# Altium schematic sheet Main IF Board 8.SchDoc: Up Converter DDR and 1st IF
size A3; Author: L Lerner; Revision: 0
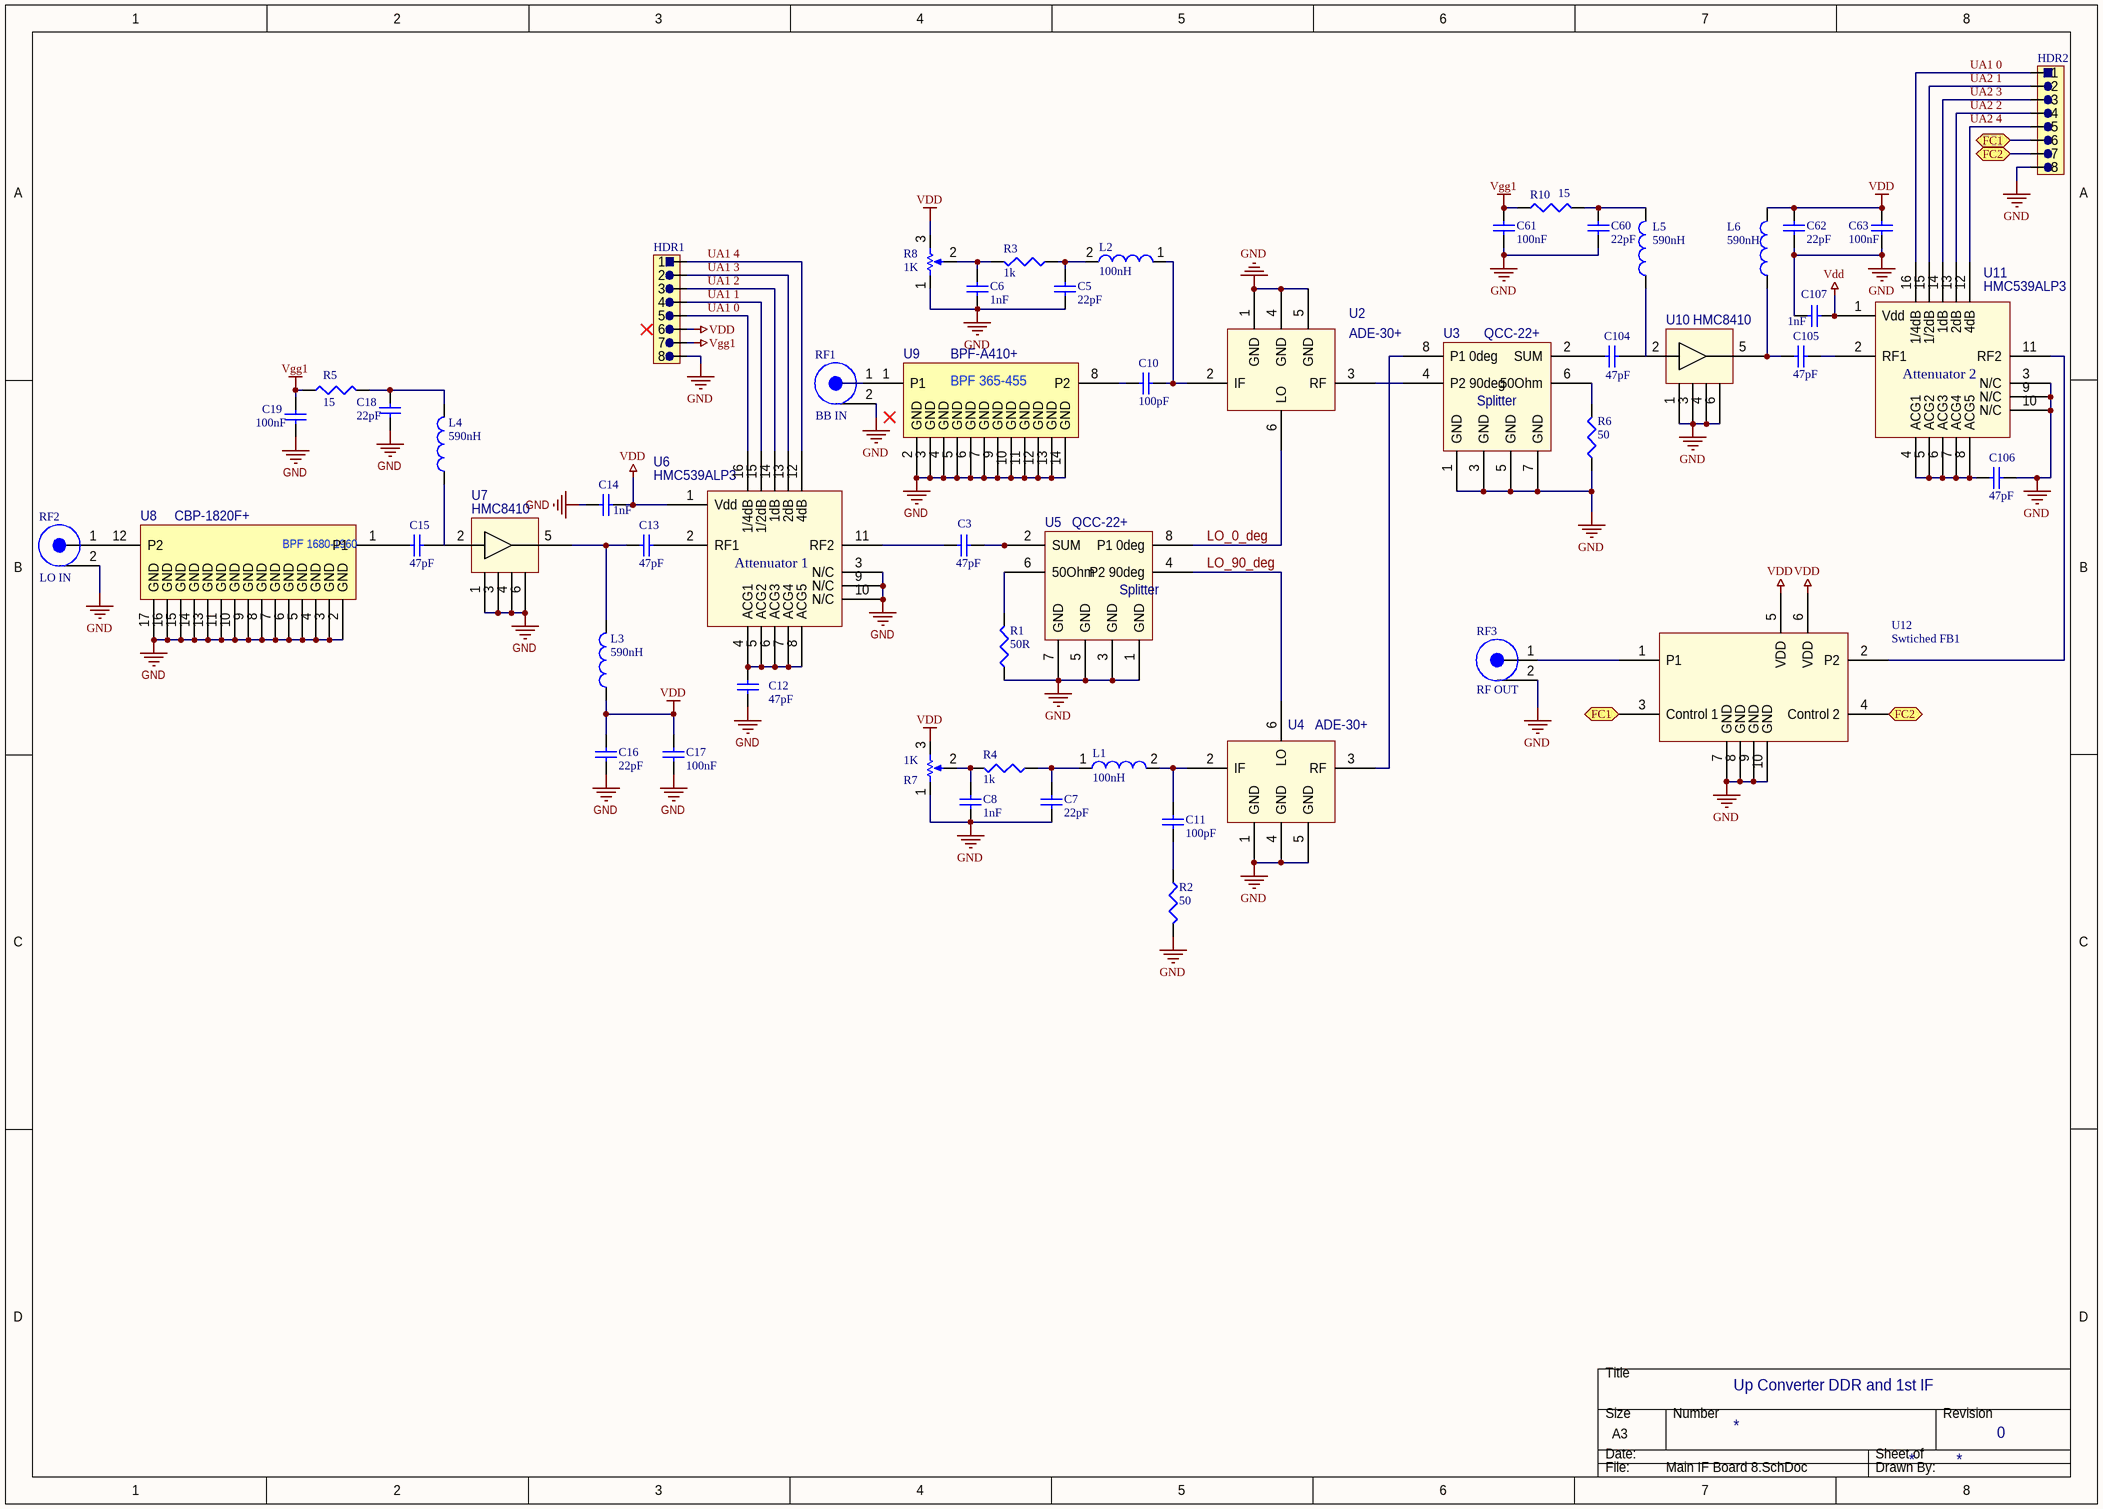
[diagram p0: Main IF Board 8.SchDoc]

## Parts
C3  value 47pF  [CAP0402]  (hidden comment: ATC520L103KT16T)
C5  value 22pF  [CAP0402]  (hidden comment: Capacitor)
C6  value 1nF  [CAP0603]  (hidden comment: Capacitor)
C7  value 22pF  [CAP0402]  (hidden comment: Capacitor)
C8  value 1nF  [CAP0603]  (hidden comment: Capacitor)
C10  value 100pF  [CAP0402]  (hidden comment: Capacitor)
C11  value 100pF  [CAP0402]  (hidden comment: Capacitor)
C12  value 47pF  [CAP0402]  (hidden comment: Capacitor)
C13  value 47pF  [CAP0402]  (hidden comment: Capacitor)
C14  value 1nF  [CAP0402]  (hidden comment: Capacitor)
C15  value 47pF  [CAP0402]  (hidden comment: Capacitor)
C16  value 22pF  [CAP0402]  (hidden comment: Capacitor)
C17  value 100nF  [CAP0402]  (hidden comment: Capacitor)
C18  value 22pF  [CAP0402]  (hidden comment: Capacitor)
C19  value 100nF  [CAP0603]  (hidden comment: Capacitor)
C60  value 22pF  [CAP0402]  (hidden comment: Capacitor)
C61  value 100nF  [CAP0402]  (hidden comment: Capacitor)
C62  value 22pF  [CAP0402]  (hidden comment: Capacitor)
C63  value 100nF  [CAP0402]  (hidden comment: Capacitor)
C104  value 47pF  [CAP0402]  (hidden comment: ATC520L103KT16T)
C105  value 47pF  [CAP0402]  (hidden comment: Capacitor)
C106  value 47pF  [CAP0402]  (hidden comment: Capacitor)
C107  value 1nF  [CAP0402]  (hidden comment: Capacitor)
HDR1  Header 8 pins  [3XHeader 100mil]  (value not drawn)
HDR2  Header 8 pins  [3XHeader 100mil]  (value not drawn)
L1  value 100nH  [Coilcraft_BCL-122]  (hidden comment: Inductor)
L2  value 100nH  [Coilcraft_BCL-122]  (hidden comment: Inductor)
L3  value 590nH  [CAP0402]  (hidden comment: Inductor)
L4  value 590nH  [CAP0402]  (hidden comment: Inductor)
L5  value 590nH  [CAP0402]  (hidden comment: Inductor)
L6  value 590nH  [TBD]  (hidden comment: Inductor)
R1  value 50R  [RES0603]  (hidden comment: Resistor)
R2  value 50  [RES0603]  (hidden comment: Resistor)
R3  value 1k  [RES0603]  (hidden comment: Resistor)
R4  value 1k  [RES0603]  (hidden comment: Resistor)
R5  value 15  [RES0402]  (hidden comment: Resistor)
R6  value 50  [RES0402]  (hidden comment: Resistor)
R7  value 1K  [Trimpot_SMD_1/4''_W&X]  (hidden comment: Pot)
R8  value 1K  [Trimpot_SMD_1/4''_W&X]  (hidden comment: Pot)
R10  value 15  [RES0402]  (hidden comment: Resistor)
RF1  BB IN  [SMA_edge_launch_cutout_Cinch]
RF2  LO IN  [SMA_board_through_hole]
RF3  RF OUT  [SMA_edge_launch_cutout_Cinch]
U2  ADE-30+  [Minicircuits_CD542]
U3  QCC-22+  [Minicircuits_GF981]
U4  ADE-30+  [Minicircuits_CD542]
U5  QCC-22+  [Minicircuits_GF981]
U6  HMC539ALP3
U7  HMC8410
U8  CBP-1820F+  [CBP-1820F+]
U9  BPF-A410+  [BPF-A410+]
U10  HMC8410  [HMC8410]
U11  HMC539ALP3  [HMC539ALP3]
U12  Swtiched FB1

## Ports
FC1 (bidir), FC2 (bidir)

## Nets
GND: C5.1 C6.2 C7.1 C8.1 C12.1 C14.1 C16.1 C17.1 C18.1 C19.1 C60.1 C61.1 C62.1 C63.1 C106.2 C107.1 HDR1.8 HDR2.8 R1.1 R2.2 R6.1 R7.1(TOP) R8.1(TOP) RF1.2 RF2.2 RF3.2 U2.1(GND) U2.4(GND) U2.5(GND) U3.1(GND) U3.3(GND) U3.5(GND) U3.7(GND) U4.1(GND) U4.4(GND) U4.5(GND) U5.1(GND) U5.3(GND) U5.5(GND) U5.7(GND) U6.3(N/C) U6.9(N/C) U6.10(N/C) U7.1 U7.3 U7.4 U7.6 U8.2(GND) U8.3(GND) U8.4(GND) U8.5(GND) U8.6(GND) U8.7(GND) U8.8(GND) U8.9(GND) U8.10(GND) U8.11(GND) U8.13(GND) U8.14(GND) U8.15(GND) U8.16(GND) U8.17(GND) U9.2(GND) U9.3(GND) U9.4(GND) U9.5(GND) U9.6(GND) U9.7(GND) U9.9(GND) U9.10(GND) U9.11(GND) U9.12(GND) U9.13(GND) U9.14(GND) U10.1 U10.3 U10.4 U10.6 U11.3(N/C) U11.9(N/C) U11.10(N/C) U12.7(GND) U12.8(GND) U12.9(GND) U12.10(GND)
VDD: C14.2 C16.2 C17.2 C62.2 C63.2 C107.2 HDR1.6 L3.1 L6.2 R7.3(BOT) R8.3(BOT) U6.1(Vdd) U11.1(Vdd) U12.5(VDD) U12.6(VDD)
Vgg1: C19.2 C61.2 HDR1.7 R5.1 R10.1
FC1: HDR2.6 U12.3(Control_1) ; port FC1
FC2: HDR2.7 U12.4(Control_2) ; port FC2
LO_0_deg: U2.6(LO) U5.8(P1_0deg)
LO_90_deg: U4.6(LO) U5.4(P2_90deg)
UA1 0: HDR1.5 HDR2.1 U6.16(1/4dB) U11.16(1/4dB)
UA1 1: HDR1.4 U6.15(1/2dB)
UA1 2: HDR1.3 U6.14(1dB)
UA1 3: HDR1.2 U6.13(2dB)
UA1 4: HDR1.1 U6.12(4dB)
UA2 1: HDR2.2 U11.15(1/2dB)
UA2 2: HDR2.4 U11.13(2dB)
UA2 3: HDR2.3 U11.14(1dB)
UA2 4: HDR2.5 U11.12(4dB)
NetC3_1: C3.1 U6.11(RF2)
NetC3_2: C3.2 U5.2(SUM)
NetC5_2: C5.2 L2.2 R3.2
NetC6_1: C6.1 R3.1 R8.2(TAP)
NetC7_2: C7.2 L1.1 R4.1
NetC8_2: C8.2 R4.2 R7.2(TAP)
NetC10_1: C10.1 U9.8(P2)
NetC10_2: C10.2 L2.1 U2.2(IF)
NetC11_1: C11.1 R2.1
NetC11_2: C11.2 L1.2 U4.2(IF)
NetC12_2: C12.2 U6.4(ACG1) U6.5(ACG2) U6.6(ACG3) U6.7(ACG4) U6.8(ACG5)
NetC13_1: C13.1 L3.2 U7.5
NetC13_2: C13.2 U6.2(RF1)
NetC15_1: C15.1 U8.1(P1)
NetC15_2: C15.2 U7.2
NetC18_2: C18.2 L4.2 R5.2
NetC60_2: C60.2 L5.2 R10.2
NetC104_1: C104.1 U10.2
NetC104_2: C104.2 U3.2(SUM)
NetC105_1: C105.1 L6.1 U10.5
NetC105_2: C105.2 U11.2(RF1)
NetC106_1: C106.1 U11.4(ACG1) U11.5(ACG2) U11.6(ACG3) U11.7(ACG4) U11.8(ACG5)
NetR1_2: R1.2 U5.6(50Ohm)
NetR6_2: R6.2 U3.6(50Ohm)
NetRF2_1: RF2.1 U8.12(P2)
NetRF3_1: RF3.1 U12.1(P1)
NetU2_3: U2.3(RF) U3.4(P2_90deg)
NetU3_8: U3.8(P1_0deg) U4.3(RF)
NetU11_11: U11.11(RF2) U12.2(P2)

Not connected (* = marked no-connect by the designer): L4 1; L5 1; RF1 1; U9 1(P1)

## Notes on the sheet
- (near U11) Attenuator 2
- (near U6) Attenuator 1
- (in symbol BPF-A410+) BPF 365-455
- (in symbol CBP-1820F+) BPF 1680-1960
- (in symbol minicircuits_QCC-22+) Splitter

## Library data of the parts
C3 C104 = Capacitor
HDR1 HDR2 = Header8: Pitch: *; Model: *
L3 L4 = Inductor: Model: 0402DF-591XJRU
R7 R8 = Pot: Potentiometer; Model: *
RF1-RF3 = RF_connector: RF connector w/  pin and barrel
  RF2: Model: *
U2 U4 = minicircuits_ADE-30+: Minicircuits mixer ADE-30+, 200MHz-3000MHz
U3 U5 = minicircuits_QCC-22+: Mini-Circuits_ power splitter/combiner QCC-22+, 1.5-2.5GHz
U12 = Switched FB1
C5-C8 C10-C19 C60-C63 C105-C107 = Capacitor
  C10-C19 C60-C63 C105-C107: Dielectric: *; Model: *; Voltage: *
L1 L2 L5 L6 = Inductor
  L5 L6: Model: *
R1-R6 R10 = Resistor
  R2-R6 R10: Type: *; Model: *